# EAGLE design daytripper_pogo (EAGLE 9.1.3)
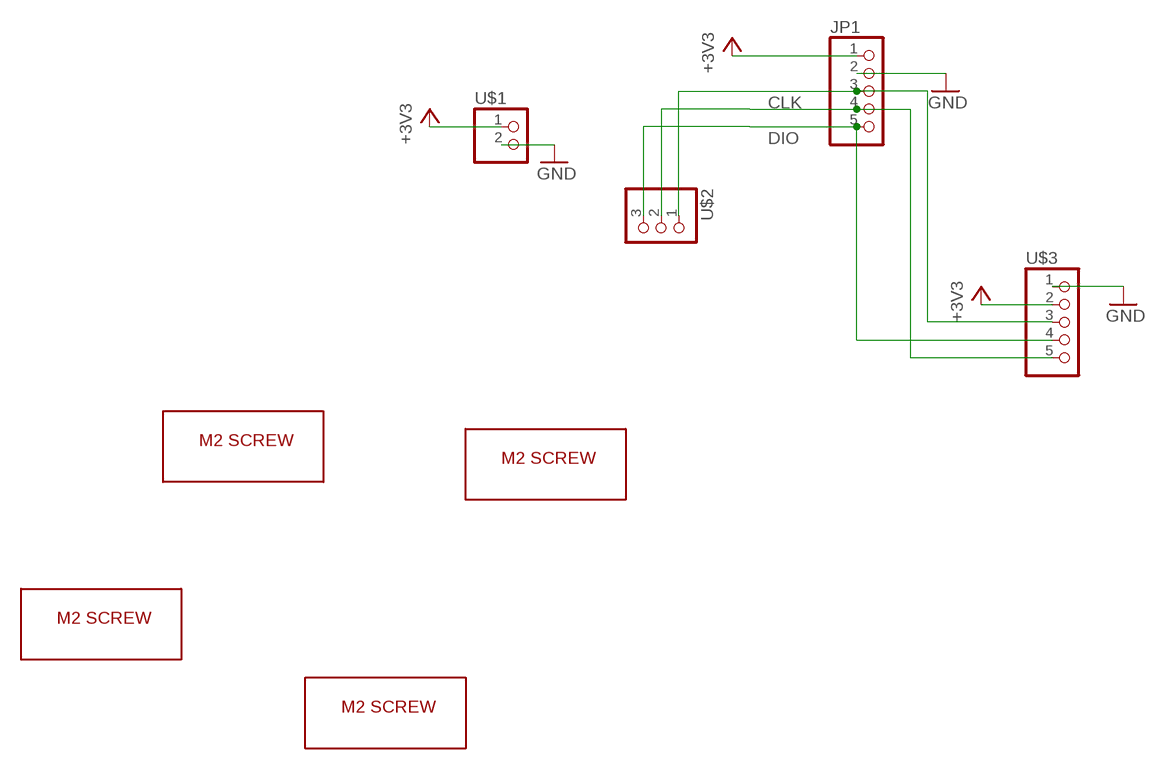
[diagram p0: schematic, sheet 1]

## Parts
JP1  PINHD-1X5  [1X05]
U$1  POGO-1X2  [1X02]
U$2  POGO-1X3  [1X03]
U$3  POGO-1X5  [1X05]
U$4  M2_SCREW_DEV  [M2_SCREW_FOOT]
U$12  M2_SCREW_DEV  [M2_SCREW_FOOT]
U$13  M2_SCREW_DEV  [M2_SCREW_FOOT]
U$14  M2_SCREW_DEV  [M2_SCREW_FOOT]

## Nets
+3V3: JP1.1 U$1.1 U$3.2
CLK: JP1.4 U$2.2 U$3.5
DIO: JP1.5 U$2.3 U$3.4
GND: JP1.2 U$1.2 U$3.1
N$1: JP1.3 U$2.1 U$3.3

## Library data of the parts
JP1 = pinhead:PINHD-1X5: PIN HEADER
U$1 = 3pos_slide_switch:POGO-1X2
U$2 = 3pos_slide_switch:POGO-1X3
U$3 = 3pos_slide_switch:POGO-1X5
U$4 U$12-U$14 = 3pos_slide_switch:M2_SCREW_DEV

## Board
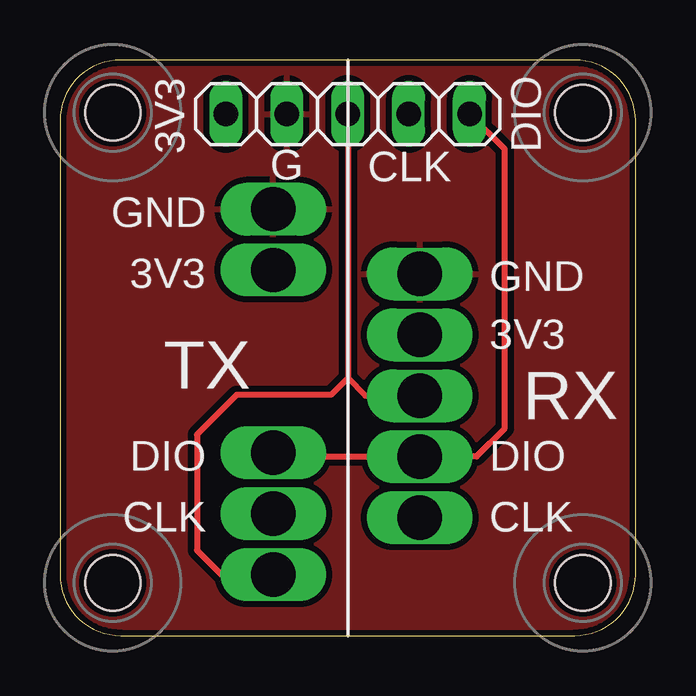
[diagram p1: board, top side]
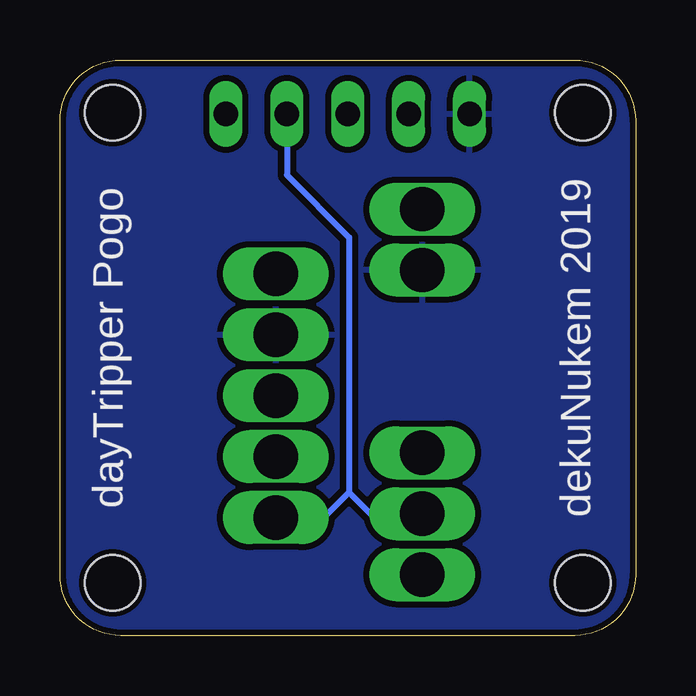
[diagram p2: board, bottom side, seen from below]

Size 24 x 24 mm. Coordinates in mm from the lower left corner, seen from the top.
Outline: 0,21.46 0,2.54 arc90 2.54,0 21.46,0 arc90 24,2.54 24,21.46 arc90 21.46,24 2.54,24 arc90 0,21.46
Copper layers (1*16): Top 0.035mm / dielectric 1.5mm / Bottom 0.035mm
Design rules "deku_2layer_6mil *": minimum track width 6mil, minimum drill 15mil, track to track 6mil, track to pad 6mil, pad to pad 6mil, via to via 6mil, smd to smd 6mil, copper to edge 10mil, drill to drill 6mil, minimum pad ring 7mil, minimum via ring 7mil, stop-mask expansion 4mil, vias tented up to drill 25mil, thermal gap 10mil

### Footprints (pad centres in the part's own frame; a part is rotated, then mirrored left to right if it is on the bottom)
1X05 = drill 1.016 long: 1 -5.08,0; 2 -2.54,0; 3 0,0; 4 2.54,0; 5 5.08,0
1X02 = drill 1.85 pad 2 long: 1 -1.27,0; 2 1.27,0
1X03 = drill 1.85 pad 2 long: 1 -2.54,0; 2 0,0; 3 2.54,0
1X05' = drill 1.85 pad 2 long: 1 -5.08,0; 2 -2.54,0; 3 0,0; 4 2.54,0; 5 5.08,0
M2_SCREW_FOOT = hole 2.3: 0,0

### Placement (x,y rotation side)
JP1  12,21.75 0 top
U$1  8.89,16.51 90 top
U$2  8.89,5.08 90 top
U$3  POGO-1X5  [1X05']  15,10 270 top
U$4  2.2,2.2 0 top
U$12  2.2,21.8 0 top
U$13  21.8,2.2 0 top
U$14  21.8,21.8 0 top

### Tracks (layer width: path | path; a pad name or v marks a point on that pad's centre or on a via)
+3V3
  pour Bottom (isolate 0.254): 0,21.46 0,2.54 arc90 2.54,0 21.46,0 arc90 24,2.54 24,21.46 arc90 21.46,24 2.54,24 arc90
CLK
  Bottom 0.254: 11.94,5.97 11.94,9.14 11.94,16.6 14.54,19.21 JP1.4 | 11.94,5.97 12.99,4.92 U$3.5 | U$2.2 11.05,5.08 11.94,5.97
DIO
  Top 0.254: JP1.5 18.54,20.28 18.54,8.64 17.37,7.46 U$3.4 9.2,7.46 9.04,7.62 U$2.3
GND
  pour Top (isolate 0.254): 0,21.46 0,2.54 arc90 2.54,0 21.46,0 arc90 24,2.54 24,21.46 arc90 21.46,24 2.54,24 arc90
N$1
  Top 0.254: JP1.3 12,10.73 | U$2.1 6.73,2.54 5.71,3.56 5.71,8.38 7.37,10.03 11.3,10.03 12,10.73 | U$3.3 12.73,10 12,10.73

### Text on the board
tNames: 3V3 | DIO | G | CLK | GND | 3V3 | GND | 3V3 | TX | RX | DIO | DIO | CLK | CLK
bNames: dekuNukem 2019 | dayTripper Pogo